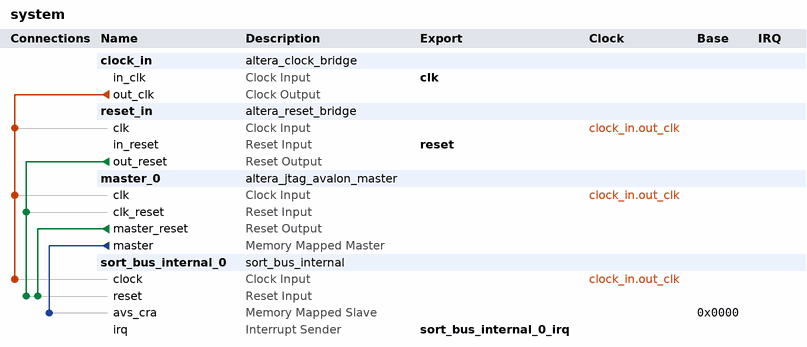
[diagram p0: system contents]
# Platform Designer (Qsys) system system, Arria 10 10AS066N3F40E2SG
# Parameters at their usual value, and those the tool derives, are not listed.
package require -exact qsys 1.0
create_system system
set_project_property DEVICE_FAMILY {Arria 10}
set_project_property DEVICE 10AS066N3F40E2SG

add_component clock_in ip/system/system_clock_in.ip altera_clock_bridge clock_in 19.2.0
load_component clock_in
set_component_parameter_value DERIVED_CLOCK_RATE 0
set_component_parameter_value EXPLICIT_CLOCK_RATE 50000000
save_component

add_component reset_in ip/system/system_reset_in.ip altera_reset_bridge reset_in 19.2.0
load_component reset_in
set_component_parameter_value ACTIVE_LOW_RESET 0
set_component_parameter_value SYNCHRONOUS_EDGES deassert
set_component_parameter_value SYNC_RESET 0
save_component

add_component master_0 ip/system/system_master_0.ip altera_jtag_avalon_master master_0 19.1
load_component master_0
save_component

add_component sort_bus_internal_0 ip/sort_bus/sort_bus.ip sort_bus_internal sort_bus_internal_0 1.0

# connections
add_connection clock_in.out_clk master_0.clk clock
add_connection clock_in.out_clk reset_in.clk clock
add_connection clock_in.out_clk sort_bus_internal_0.clock clock
add_connection master_0.master_reset sort_bus_internal_0.reset reset
add_connection reset_in.out_reset master_0.clk_reset reset
add_connection reset_in.out_reset sort_bus_internal_0.reset reset
add_connection master_0.master sort_bus_internal_0.avs_cra avalon
set_connection_parameter_value master_0.master/sort_bus_internal_0.avs_cra baseAddress 0x0000

# exported interfaces
add_interface clk clock sink
set_interface_property clk EXPORT_OF clock_in.in_clk
add_interface reset reset sink
set_interface_property reset EXPORT_OF reset_in.in_reset
add_interface sort_bus_internal_0_irq interrupt sender
set_interface_property sort_bus_internal_0_irq EXPORT_OF sort_bus_internal_0.irq

save_system system.qsys
